# EAGLE design 2WLS-PASSIVE (EAGLE 7.4.0)
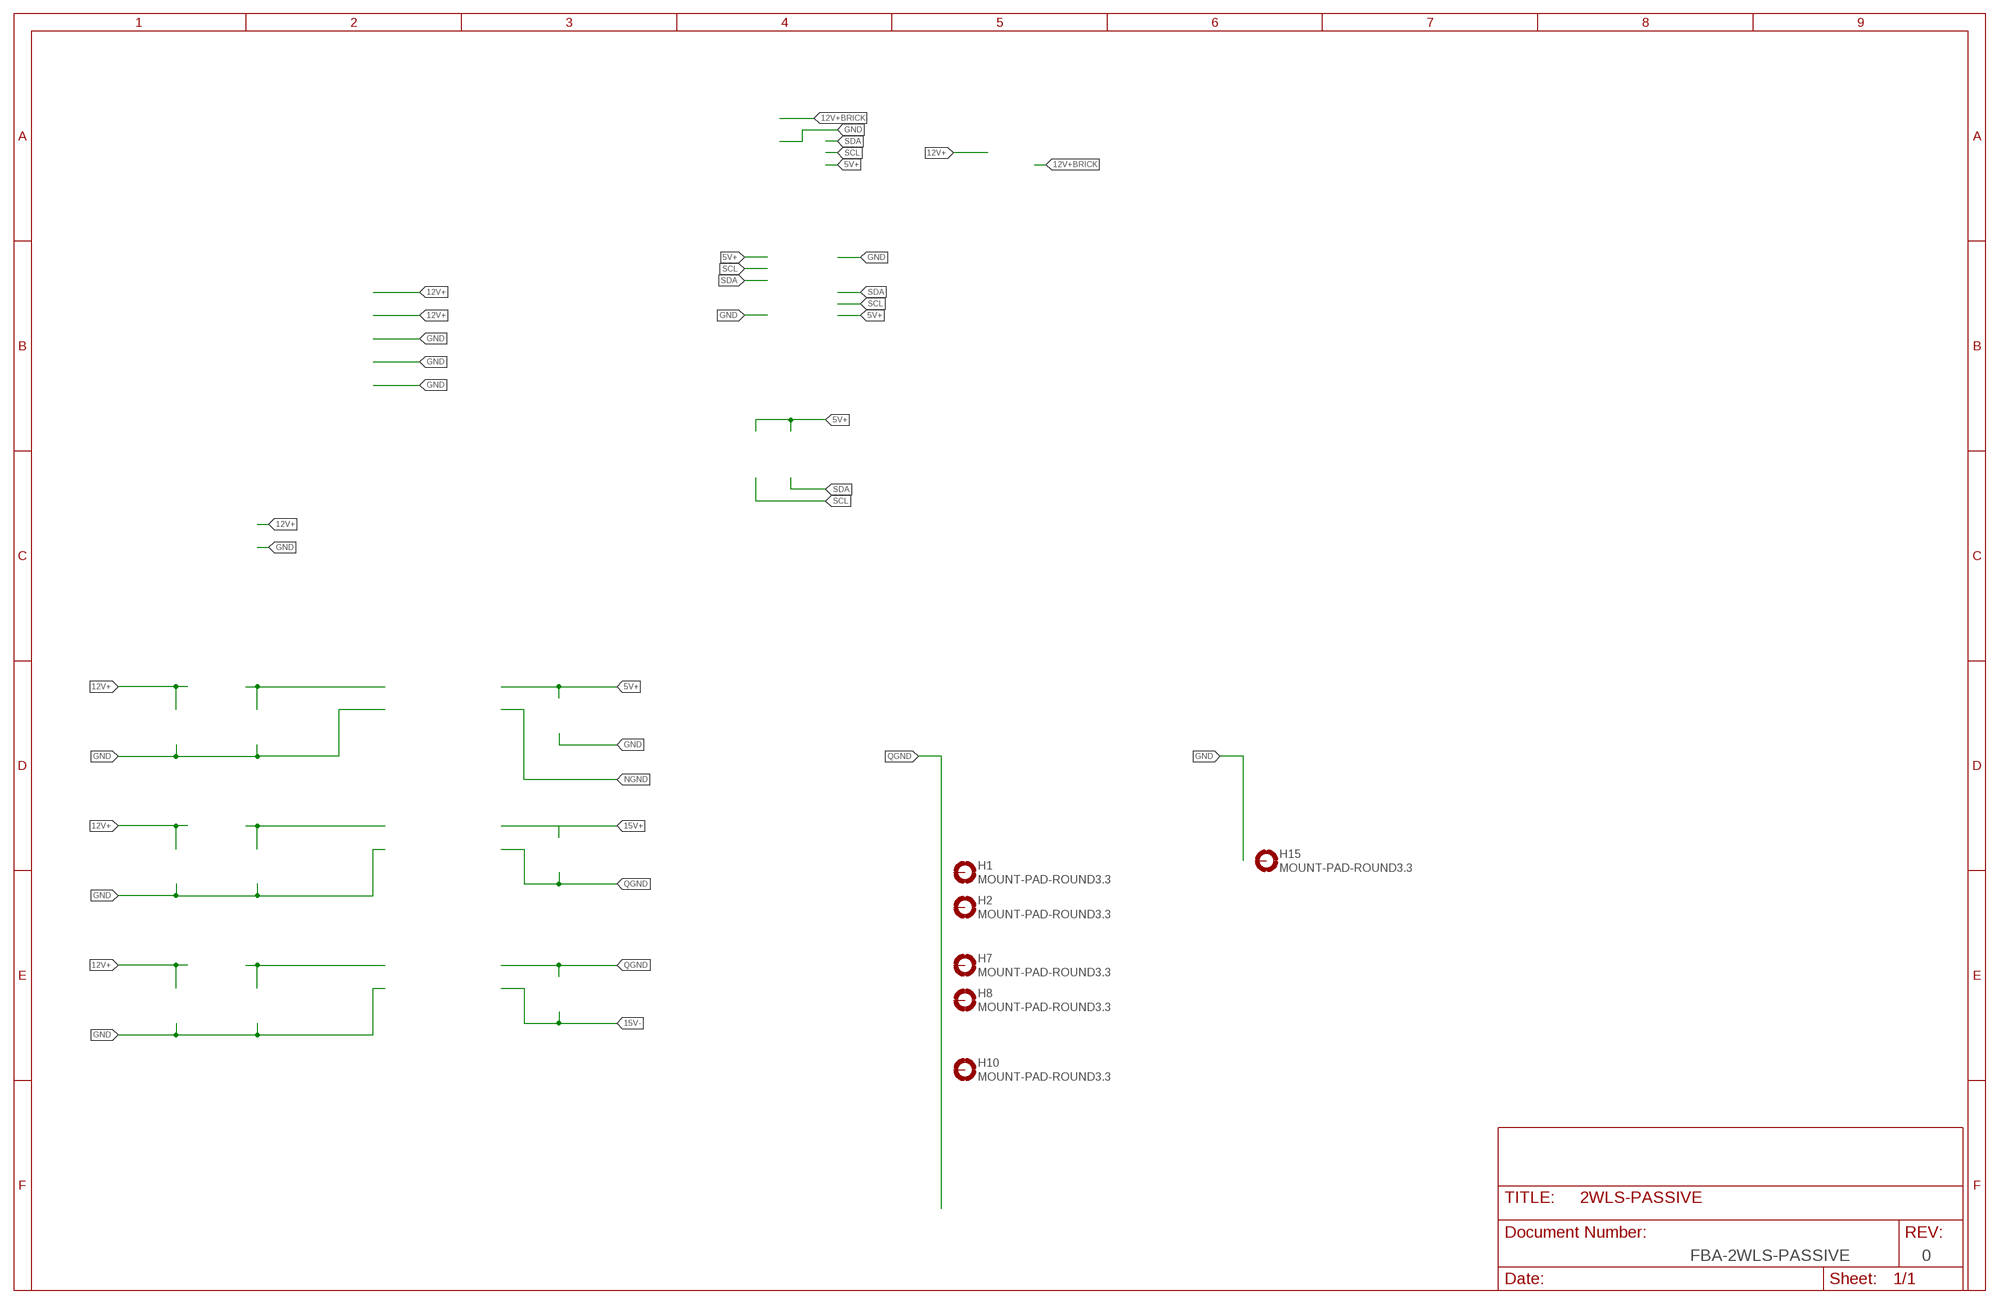
[diagram p0: schematic, sheet 1]

## Parts
H1  MOUNT-PAD-ROUND3.3  [3,3-PAD]
H2  MOUNT-PAD-ROUND3.3  [3,3-PAD]
H7  MOUNT-PAD-ROUND3.3  [3,3-PAD]
H8  MOUNT-PAD-ROUND3.3  [3,3-PAD]
H10  MOUNT-PAD-ROUND3.3  [3,3-PAD]
H15  MOUNT-PAD-ROUND3.3  [3,3-PAD]
Unconnected: H1.B3,3(MOUNT) H2.B3,3(MOUNT) H7.B3,3(MOUNT) H8.B3,3(MOUNT) H10.B3,3(MOUNT) H15.B3,3(MOUNT)

## Notes on the sheet
- FBA-2WLS-PASSIVE | 0

## Library data of the parts
H1 H2 H7 H8 H10 H15 = holes:MOUNT-PAD-ROUND: MOUNTING PAD, round

## Net classes
0 Signal: width 0.254 mm, clearance 0.205 mm
1 Power: width 0.508 mm, clearance 0.205 mm to class 0, clearance 0.205 mm
2 GND: width 0.889 mm

## Board
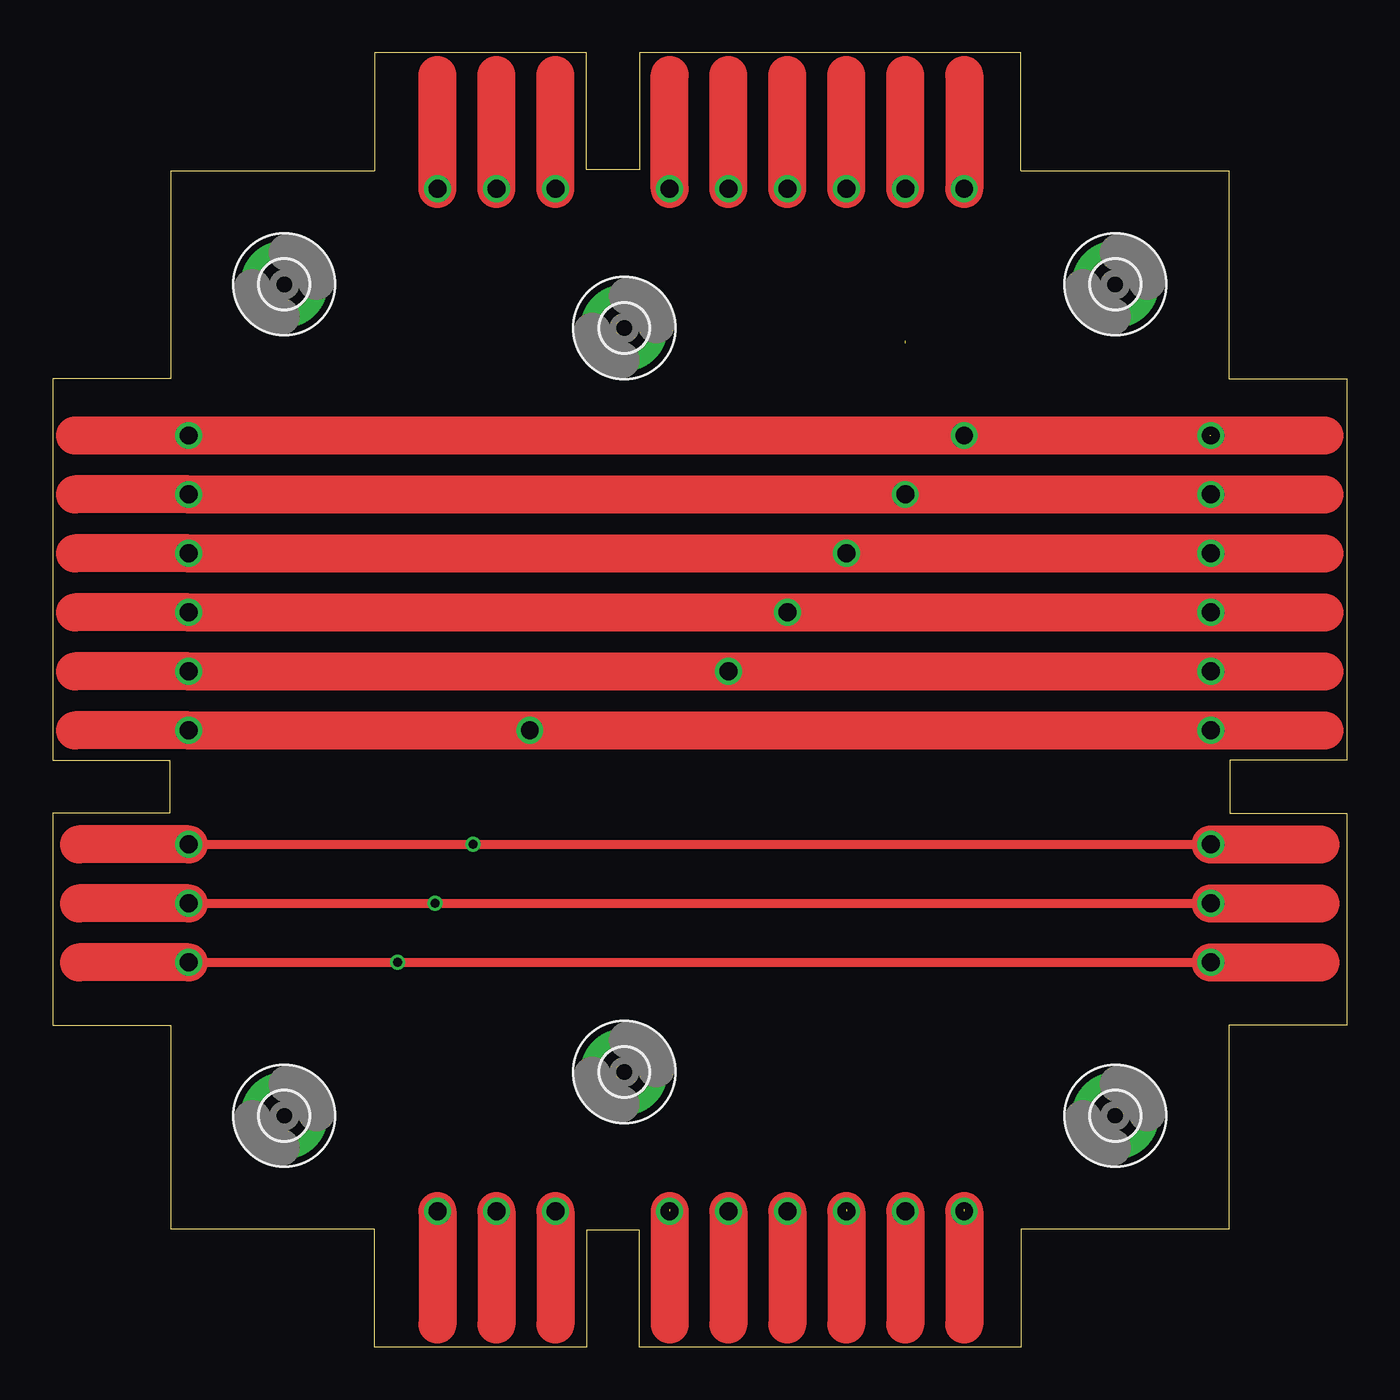
[diagram p1: board, top side]
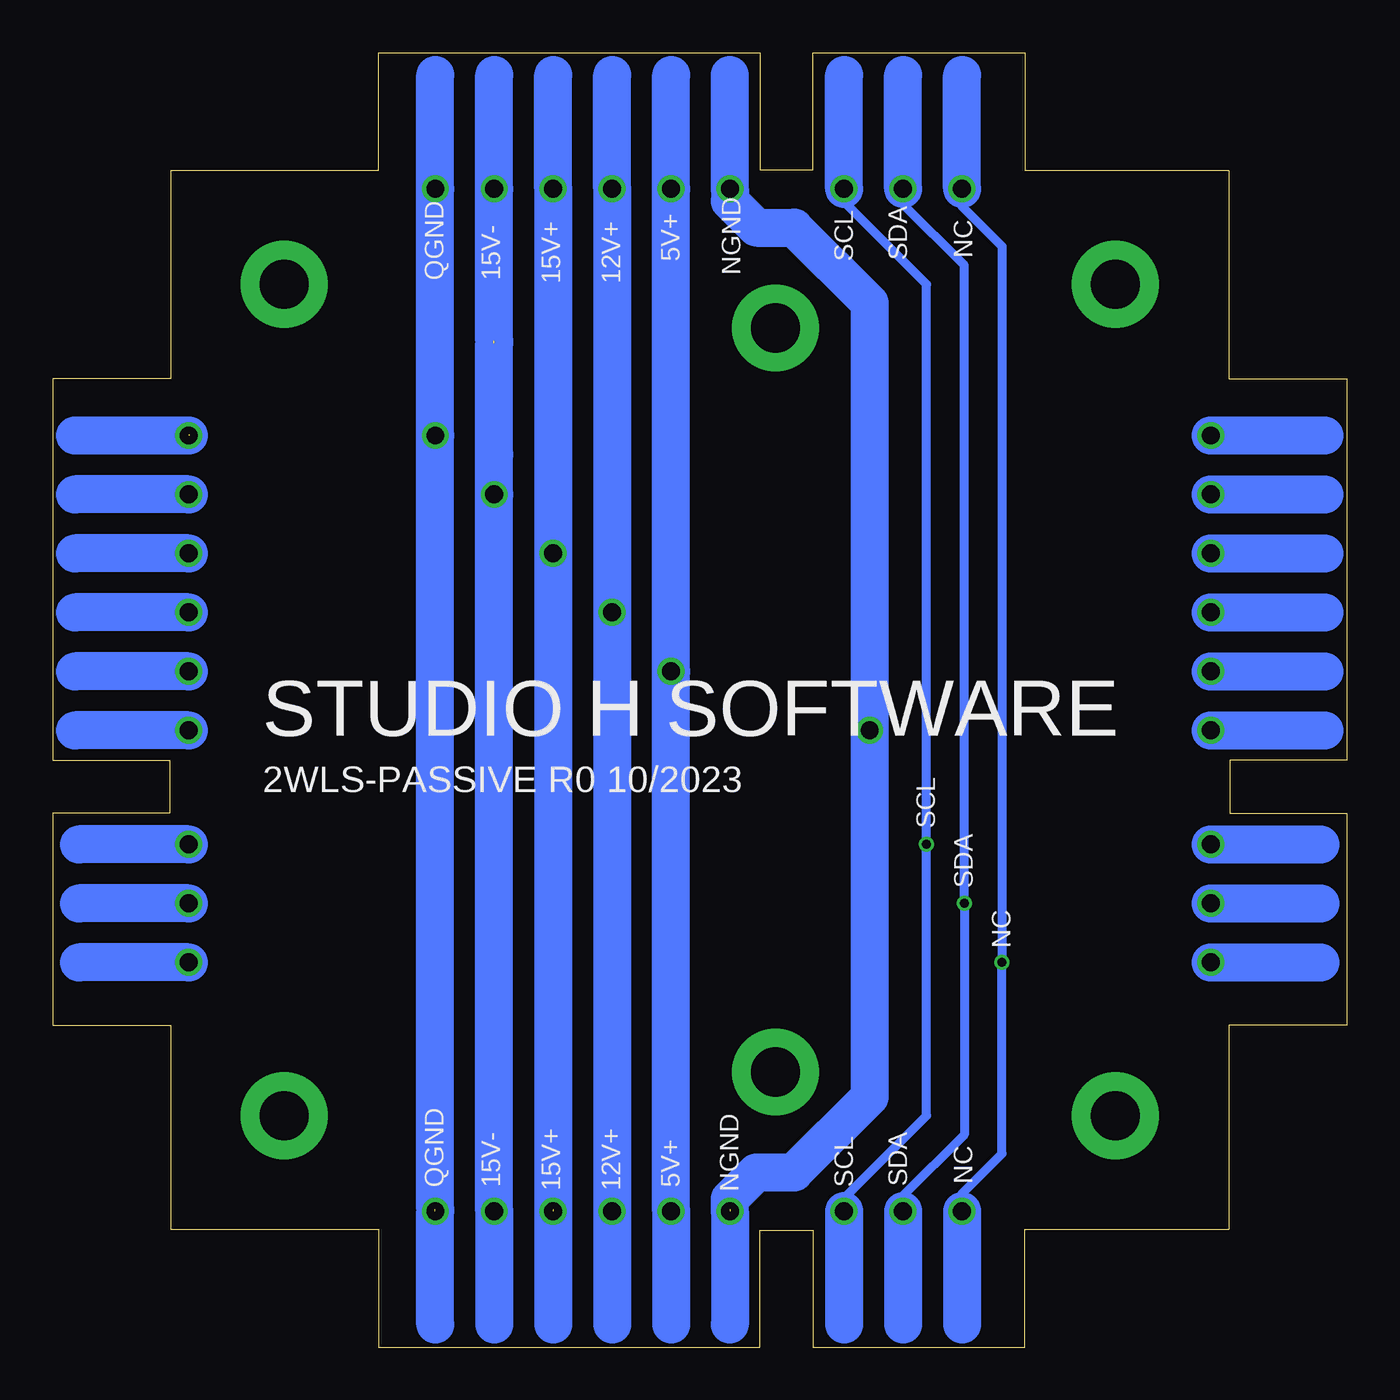
[diagram p2: board, bottom side, seen from below]

Size 87 x 87 mm. Coordinates in mm from the lower left corner, seen from the top.
Outline: 7.94,65.09 0,65.09 0,39.43 7.87,39.43 7.87,35.88 0,35.88 0,21.65 7.94,21.65 7.94,7.94 21.65,7.94 21.65,0 35.88,0 35.88,7.87 39.43,7.87 39.43,0 65.09,0 65.09,7.94 79.06,7.94 79.06,21.65 87,21.65 87,35.88 79.12,35.88 79.12,39.43 87,39.43 87,65.09 79.06,65.09 79.06,79.06 65.09,79.06 65.09,87 39.43,87 39.43,79.12 35.88,79.12 35.88,87 21.65,87 21.65,79.06 7.94,79.06 7.94,65.09
Copper layers (1*16): Top 0.035mm / dielectric 0.2mm / Bottom 0.035mm
Design rules "default *": minimum track width 10mil, minimum drill 20mil, track to track 8mil, track to pad 8mil, pad to pad 8mil, via to via 8mil, smd to smd 8mil, copper to edge 40mil, drill to drill 8mil, minimum pad ring 10mil, minimum via ring 8mil, stop-mask expansion 4mil, vias tented up to drill 0mil, thermal gap 10mil

### Footprints (pad centres in the part's own frame; a part is rotated, then mirrored left to right if it is on the bottom)
3,3-PAD = drill 3.3 pad 5.842: B3,3 0,0

### Placement (x,y rotation side)
H1  71.44,71.44 0 top
H2  71.44,15.56 0 top
H7  15.56,71.44 0 top
H8  15.56,15.56 0 top
H10  38.42,18.5 0 top
H15  38.42,68.5 0 top

### Tracks (layer width: path | path; a pad name or v marks a point on that pad's centre or on a via)
5V+  (via drill 1.2)
  Top 2.54: v45.43,9.14 45.43,1.52 | v45.43,77.85 45.43,85.5 | 85.5,45.43 v77.85,45.43 v45.43,45.43 v9.14,45.43 1.49,45.43
  Bottom 2.54: 45.43,1.52 v45.43,9.14 v45.43,45.43 v45.43,77.85 45.43,85.5 | v77.85,45.43 85.5,45.43 | v9.14,45.43 1.49,45.43
12V+  (via drill 1.2)
  Top 2.54: v49.39,9.14 49.39,1.52 | v49.39,77.85 49.39,85.5 | 85.5,49.39 v77.85,49.39 v49.39,49.39 v9.14,49.39 1.49,49.39
  Bottom 2.54: 49.39,1.52 v49.39,9.14 v49.39,49.39 v49.39,77.85 49.39,85.5 | v77.85,49.39 85.5,49.39 | v9.14,49.39 1.49,49.39
15V+  (via drill 1.2)  (1 unrouted)
  Top 2.54: 1.49,53.35 v9.14,53.35 v53.35,53.35 v77.85,53.35 85.5,53.35 | v53.35,9.14 53.35,1.52 | v53.35,77.85 53.35,85.5
  Bottom 2.54: v9.14,53.35 1.49,53.35 | v53.35,9.14 53.35,1.52 | 53.35,85.5 v53.35,77.85 v53.35,53.35 53.35,9.27 | v77.85,53.35 85.5,53.35
15V-  (via drill 1.2)  (1 unrouted)
  Top 2.54: 1.49,57.32 v9.14,57.32 v57.32,57.32 v77.85,57.32 85.5,57.32 | v57.32,9.14 57.32,1.52 | v57.32,77.85 57.32,85.5
  Bottom 0.61: v57.32,57.32 57.47,57.32 57.47,60.01 57.32,60.01
  Bottom 2.54: v9.14,57.32 1.49,57.32 | 57.32,1.52 v57.32,9.14 v57.32,57.32 57.32,60.01 57.32,67.48 | 57.32,85.5 v57.32,77.85 57.32,67.63 | v77.85,57.32 85.5,57.32
NC  (via drill 0.6, 1.2)
  Top 0.61: v77.85,25.87 v23.18,25.87 v9.14,25.87
  Top 2.54: v9.14,25.87 1.75,25.87 | v25.87,9.14 25.87,1.52 | v25.87,77.85 25.87,85.5 | v77.85,25.87 85.25,25.87
  Bottom 0.61: v25.87,9.14 25.87,10.33 23.18,13.02 v23.18,25.87 23.18,73.98 25.87,76.67 v25.87,77.85
  Bottom 2.54: v9.14,25.87 1.75,25.87 | v25.87,9.14 25.87,1.52 | v25.87,77.85 25.87,85.5 | v77.85,25.87 85.25,25.87
NGND  (via drill 1.2)  (1 unrouted)
  Top 2.54: 1.49,41.47 v9.14,41.47 v32.07,41.47 v77.85,41.47 85.5,41.47 | v41.47,9.14 41.47,1.52 | v41.47,77.85 41.47,85.5
  Bottom 2.54: v9.14,41.47 1.49,41.47 | v41.47,9.14 41.47,1.52 | 41.47,85.5 v41.47,77.85 41.47,77.03 39.69,75.25 37.15,75.25 32.07,70.17 v32.07,41.47 32.07,16.83 37.15,11.75 39.69,11.75 41.47,9.97 41.47,9.27 | v77.85,41.47 85.5,41.47
QGND  (via drill 1.2)  (2 unrouted)
  Top 2.54: v61.28,9.14 61.28,1.52 | 61.28,85.5 v61.28,77.85 | v77.85,61.28 85.5,61.28 | 1.49,61.28 v9.14,61.28 v61.28,61.28 77.79,61.28
  Bottom 2.54: 61.28,1.52 v61.28,9.14 | 61.28,85.5 v61.28,77.85 v61.28,61.28 61.28,9.27 | 85.5,61.28 v77.85,61.28 | v9.14,61.28 1.49,61.28
SCL  (via drill 0.6, 1.2)
  Top 0.61: v28.26,33.79 v77.85,33.79 | v28.26,33.79 77.79,33.79 | v9.14,33.79 v28.26,33.79
  Top 2.54: v9.14,33.79 1.75,33.79 | v33.79,77.85 33.79,85.5 | v77.85,33.79 85.25,33.79 | v33.79,9.14 33.79,1.52
  Bottom 0.61: v33.79,77.85 33.79,76.97 28.26,71.44 v28.26,33.79 28.26,15.56 33.79,10.02 v33.79,9.14
  Bottom 2.54: v9.14,33.79 1.75,33.79 | v33.79,77.85 33.79,85.5 | v77.85,33.79 85.25,33.79 | v33.79,9.14 33.79,1.52
SDA  (via drill 0.6, 1.2)
  Top 0.61: v25.72,29.83 v77.85,29.83 | v25.72,29.83 77.79,29.83 | v9.14,29.83 v25.72,29.83
  Top 2.54: v29.83,9.14 29.83,1.52 | v29.83,77.85 29.83,85.5 | v77.85,29.83 85.25,29.83 | v9.14,29.83 1.75,29.83
  Bottom 0.61: v29.83,9.14 29.83,10.17 25.72,14.29 v25.72,29.83 25.72,72.71 29.83,76.82 v29.83,77.85
  Bottom 2.54: v29.83,9.14 29.83,1.52 | v29.83,77.85 29.83,85.5 | v77.85,29.83 85.25,29.83 | v9.14,29.83 1.75,29.83

### Text on the board
bNames: NC | SDA | SCL | 5V+ | NGND | 12V+ | 15V+ | 15V- | QGND | STUDIO H SOFTWARE | 2WLS-PASSIVE R0 10/2023 | SCL | SDA | NC | NC | SDA | SCL | NGND | 5V+ | 12V+ | 15V+ | 15V- | QGND